# EAGLE design micronucleus_usb_dev_stick_no_pins (EAGLE 9.5.2)
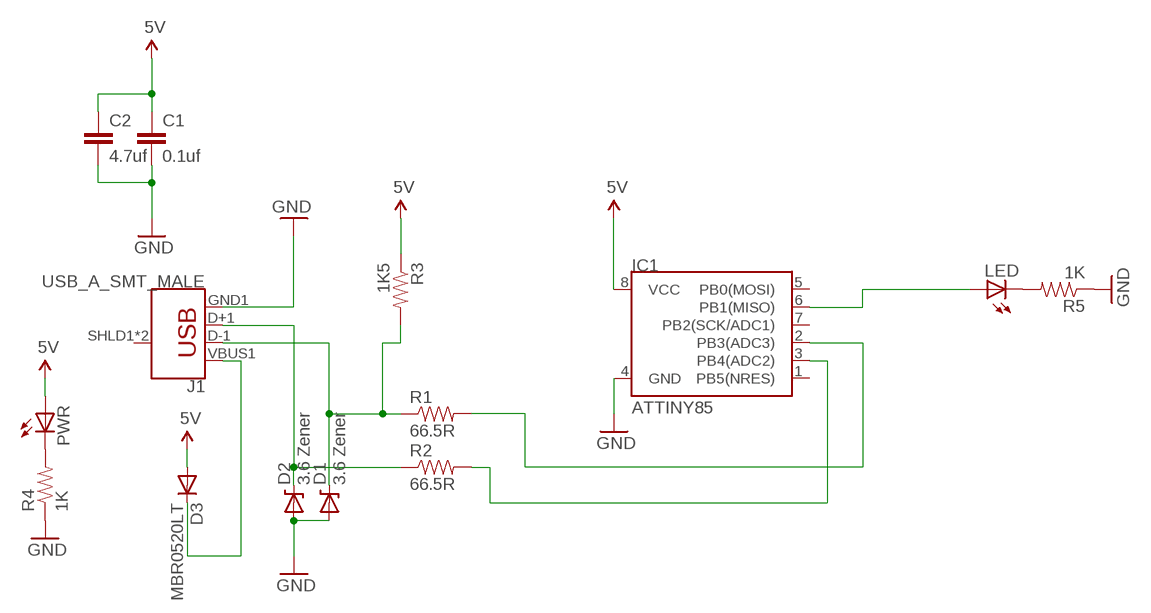
[diagram p0: schematic, sheet 1]

## Parts
C1  0.1uf  CAP0402-CAP  [0402-CAP]
C2  4.7uf  CAP0805  [0805]
D1  3.6 Zener  DIODE-ZENER-BZT52  [SOD-323]
D2  3.6 Zener  DIODE-ZENER-BZT52  [SOD-323]
D3  MBR0520LT  [SOD123]
IC1  ATTINY85  ATTINY45  [SO08-EIAJ]
J1  USB_A_SMT_MALE  [USB-A-SMT-MALE]
LED  LED0603  [LED-0603]
PWR  LED0603  [LED-0603]
R1  66.5R  RESISTOR0402-RES  [0402-RES]
R2  66.5R  RESISTOR0402-RES  [0402-RES]
R3  1K5  RESISTOR0402-RES  [0402-RES]
R4  1K  RESISTOR0402-RES  [0402-RES]
R5  1K  RESISTOR0402-RES  [0402-RES]

## Nets
5V: C1.1 C2.1 D3.A IC1.8(VCC) PWR.A R3.1
GND: C1.2 C2.2 D1.2(A) D2.2(A) IC1.4(GND) J1.GND1(GND) R4.1 R5.1
N$1: IC1.2(PB3(ADC3)) R1.2
N$2: IC1.6(PB1(MISO)) LED.A
N$4: D3.C J1.VBUS1(VBUS)
N$6: IC1.3(PB4(ADC2)) R2.2
N$10: D1.1(C) J1.D-1(D-) R1.1 R3.2
N$11: D2.1(C) J1.D+1(D+) R2.1
N$12: LED.C R5.2
N$17: PWR.C R4.2
Unconnected: IC1.1(PB5(NRES)) IC1.5(PB0(MOSI)) IC1.7(PB2(SCK/ADC1)) J1.SHLD1(SHIELD) J1.SHLD2(SHIELD)

## Library data of the parts
C1 C2 = SparkFun:CAP: Capacitor Standard 0603 ceramic capacitor, and 0.1" leaded capacitor.
D1 D2 = SparkFun:DIODE-ZENER: Zener Diode Production Part - 8199 3.4V Zener Voltage
D3 = diode:MBR0520LT: SCHOTTKY BARRIER RECTIFIER Source: http://onsemi.com .. MBR0520LT1-D.pdf
IC1 = SparkFun:ATTINY45: Atmel ATTiny45
J1 = SparkFun-Connectors:USB_A: USB-A Connector Male and female variants, as well as PTH and SMT variants SparkFun Products: SparkFun XBee Explorer Dongle <https://www.sparkfun.com/products/11697> PTH Male SparkFun MicroView-USB Programmer <https://www.sparkfun.com/products/12924> SMT Male SparkFun USB Type A Female Breakout <https://www.sparkfun.com/products/12700> SMT Female; PROD_ID: CONN-11499
LED PWR = SparkFun:LED: LEDs Standard schematic elements and footprints for 5mm, 3mm, 1206, and 0603 sized LEDs. 5mm - Spark Fun Electronics SKU : COM-00529 (and others)
R1-R5 = SparkFun:RESISTOR: Resistor Basic schematic elements and footprints for 0603, 1206, and PTH resistors.

## Board
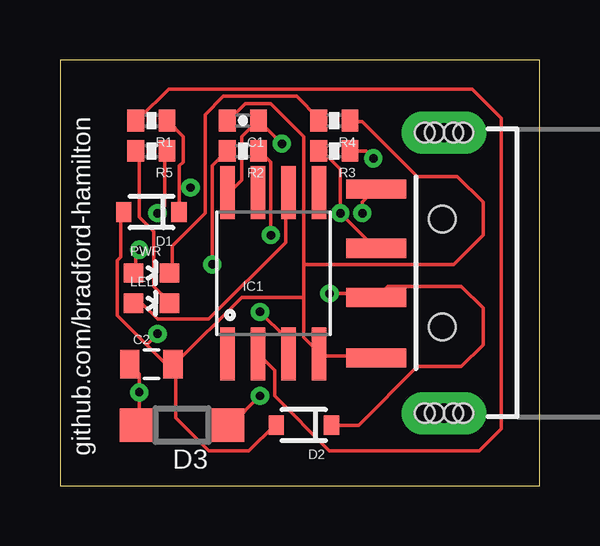
[diagram p1: board, top side]
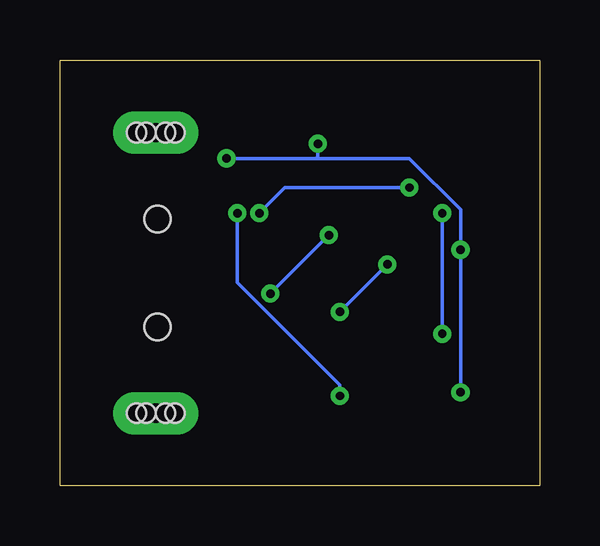
[diagram p2: board, bottom side, seen from below]

Size 19.99 x 17.77 mm. Coordinates in mm from the lower left corner, seen from the top.
Outline: 0,0 19.99,0 19.99,17.77 0,17.77 0,0
Copper layers (1*16): Top 0.035mm / dielectric 1.5mm / Bottom 0.035mm
Design rules "default": minimum track width 6mil, minimum drill 0.35mm, track to track 6mil, track to pad 6mil, pad to pad 6mil, via to via 6mil, smd to smd 6mil, copper to edge 40mil, drill to drill 6mil, minimum pad ring 10mil, minimum via ring 8mil, stop-mask expansion 4mil, vias tented up to drill 0mil, thermal gap 10mil

### Footprints (pad centres in the part's own frame; a part is rotated, then mirrored left to right if it is on the bottom)
0402-CAP = smd 0.7 x 0.9: 1 -0.65,0; 2 0.65,0
0805 = smd 0.8 x 1.2: 1 -0.9,0; 2 0.9,0
SOD-323 = smd 0.63 x 0.83: 1 -1.15,0; 2 1.15,0
SOD123 = smd 1.4 x 1.4: A 1.9,0; C -1.9,0
SO08-EIAJ = smd 0.61 x 2.21: 1 -1.905,-3.378; 2 -0.635,-3.378; 3 0.635,-3.378; 4 1.905,-3.378; 5 1.905,3.353; 6 0.635,3.353; 7 -0.635,3.353; 8 -1.905,3.353
USB-A-SMT-MALE = smd 2.5 x 0.8: D+1 10.95,1.027; D-1 10.95,-1.027; GND1 10.95,3.551; VBUS1 10.95,-3.5 | drill 0.8 pad 1.778 long: SHLD1 8.13,-5.85; SHLD2 8.13,5.85 | hole 1.1: 8.2,2.25; 8.2,-2.25 | hole 0.8: 8.53,-5.85; 8.93,-5.85; 7.73,-5.85; 7.33,-5.85; 8.53,5.85; 8.93,5.85; 7.73,5.85; 7.33,5.85
LED-0603 = smd 0.8 x 0.8: A 0,-0.75; C 0,0.75
0402-RES = smd 0.7 x 0.9: 1 -0.65,0; 2 0.65,0

### Placement (x,y rotation side)
C1  7.62,15.24 180 top
C2  3.81,5.08 0 top
D1  3.81,11.43 180 top
D2  10.16,2.54 180 top
D3  5.08,2.54 180 top
IC1  8.89,8.89 0 top
J1  24.13,8.89 180 top
LED  3.81,7.62 270 top
PWR  3.81,8.89 270 top
R1  3.81,15.24 180 top
R2  7.62,13.97 180 top
R3  11.43,13.97 180 top
R4  11.43,15.24 180 top
R5  3.81,13.97 180 top

### Tracks (layer width: path | path; a pad name or v marks a point on that pad's centre or on a via)
5V  (via drill 0.35)
  Top 0.152: IC1.8 7.11,12.29 7.57,12.75 7.57,14.58 8.18,15.19 C1.1 8.33,15.19 v9.25,14.28 | v3.3,9.86 3.15,9.7 3.15,8.94 PWR.A | C2.1 3,4.98 3.3,4.67 v3.3,3.91 3.3,2.54 D3.A | R3.1 12.75,13.97 v13.06,13.67
  Bottom 0.152: v3.3,3.91 v3.3,9.86 3.3,11.53 5.44,13.67 9.25,13.67 | 9.25,13.67 v13.06,13.67 | 9.25,13.67 v9.25,14.28
GND  (via drill 0.35)
  Top 0.152: 3.61,5.89 4.37,5.13 4.67,5.13 C2.2 | 3.61,5.89 2.39,7.11 2.39,9.4 2.54,9.55 2.54,11.38 D1.2 | D2.2 8.94,2.54 7.87,1.47 6.2,1.47 4.83,2.85 4.83,4.98 C2.2 | v4.06,11.38 4.37,11.68 4.37,13.97 R5.1 | 3.61,5.89 v4.06,6.35 | 10.16,7.87 10.16,6.2 10.77,5.59 IC1.4 10.92,5.44 13.06,5.44 J1.GND1 | 10.16,7.87 10.16,9.25 | 10.16,9.25 10.16,14.58 8.79,15.95 7.72,15.95 7.11,15.34 C1.2 | 10.16,9.25 16.41,9.25 17.63,10.46 17.63,11.84 16.56,12.9 14.88,12.9 12.6,15.19 12.14,15.19 R4.1 | 10.16,7.87 7.57,7.87 4.83,5.13 C2.2
  Bottom 0.152: v4.06,6.35 v4.06,11.38
N$1
  Top 0.152: IC1.2 8.94,4.83 8.94,3.76 11.23,1.47 17.47,1.47 18.39,2.39 18.39,15.34 17.17,16.56 4.52,16.56 3.3,15.34 R1.2
N$2
  Top 0.152: LED.A 3.15,7.57 3.45,7.57 4.06,6.96 6.2,6.96 9.4,10.16 9.4,12.14 IC1.6
N$4  (via drill 0.35)
  Top 0.152: v8.33,3.76 7.11,2.54 D3.C | v12.6,11.38 12.6,11.84 13.06,12.29 J1.VBUS1
  Bottom 0.152: v8.33,3.76 8.33,4.22 12.6,8.48 v12.6,11.38
N$6  (via drill 0.35)
  Top 0.152: v6.35,9.25 6.35,13.36 R2.2 | v8.33,7.26 9.4,6.2 9.4,5.59 IC1.3
  Bottom 0.152: v8.33,7.26 v6.35,9.25
N$10  (via drill 0.35)
  Top 0.152: 4.98,12.45 4.98,13.36 5.13,13.51 5.13,14.58 4.52,15.19 R1.1 | 4.98,12.45 4.98,11.53 D1.1 | R3.2 10.92,13.97 11.68,13.21 v11.68,11.38 13.06,10.01 J1.D-1 | v5.44,12.45 4.98,12.45
  Bottom 0.152: v5.44,12.45 10.62,12.45 v11.68,11.38
N$11  (via drill 0.35)
  Top 0.152: D2.1 12.45,2.54 14.88,4.98 16.71,4.98 17.63,5.89 17.63,7.42 16.71,8.33 13.66,8.33 13.21,7.87 J1.D+1 13.06,7.87 12.9,8.03 v11.23,8.03 | v8.79,10.46 8.79,13.51 8.33,13.97 R2.1
  Bottom 0.152: v11.23,8.03 v8.79,10.46
N$12
  Top 0.152: LED.C 4.52,7.72 3.91,8.33 3.91,10.62 3.3,11.23 3.3,13.97 R5.2
N$17
  Top 0.152: PWR.C 4.67,8.94 4.67,10.01 6.04,11.38 6.04,15.49 6.81,16.26 9.85,16.26 10.77,15.34 R4.2

### Text on the board
tNames: github.com/bradford-hamilton